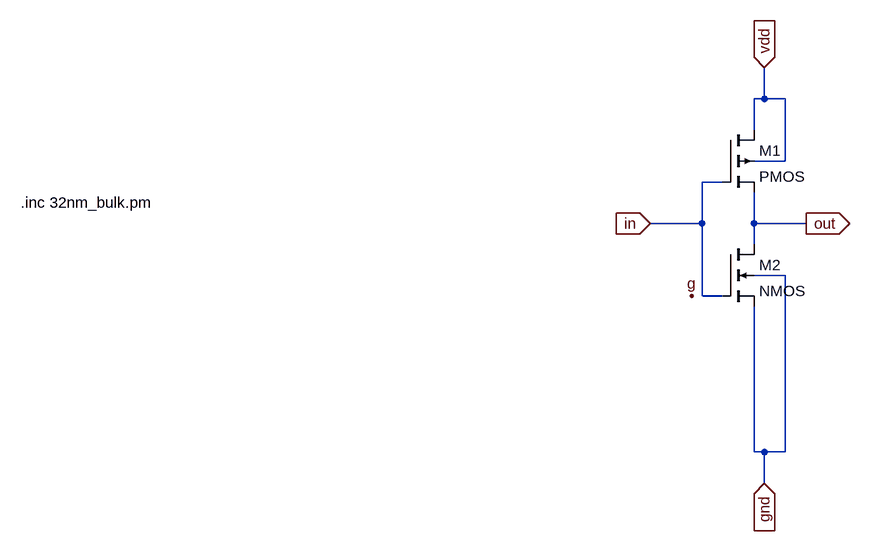
[diagram p0: schematic invert.asc]
invert.asc, the LTspice schematic file:
Version 4
SHEET 1 1184 680
WIRE 208 -80 208 -128
WIRE 208 -80 192 -80
WIRE 240 -80 208 -80
WIRE 192 -32 192 -80
WIRE 240 16 240 -80
WIRE 240 16 192 16
WIRE 144 48 112 48
WIRE 112 112 112 48
WIRE 112 112 32 112
WIRE 192 112 192 64
WIRE 272 112 192 112
WIRE 192 144 192 112
WIRE 240 192 192 192
WIRE 112 224 112 112
WIRE 144 224 112 224
WIRE 192 464 192 240
WIRE 208 464 192 464
WIRE 240 464 240 192
WIRE 240 464 208 464
WIRE 208 512 208 464
FLAG 96 224 g
FLAG 208 -128 vdd
IOPIN 208 -128 In
FLAG 208 512 gnd
IOPIN 208 512 In
FLAG 32 112 in
IOPIN 32 112 In
FLAG 272 112 out
IOPIN 272 112 Out
SYMBOL pmos4 144 -32 R0
SYMATTR InstName M1
SYMATTR Value2 l=32e-9 w=640e-9 ad=51200e-18 as=51200e-18 pd=960e-9 ps=960e-9
SYMBOL nmos4 144 144 R0
SYMATTR InstName M2
SYMATTR Value2 l=32e-9 w=320e-9 ad=51200e-18 as=51200e-18 pd=960e-9 ps=960e-9
TEXT -936 80 Left 2 !.inc 32nm_bulk.pm

The netlist it stands for:
* invert.asc
M1 vdd in out vdd PMOS l=32e-9 w=640e-9 ad=51200e-18 as=51200e-18 pd=960e-9 ps=960e-9
M2 out in gnd gnd NMOS l=32e-9 w=320e-9 ad=51200e-18 as=51200e-18 pd=960e-9 ps=960e-9
.model NMOS NMOS
.model PMOS PMOS
.lib standard.mos
.inc 32nm_bulk.pm
.backanno
.end